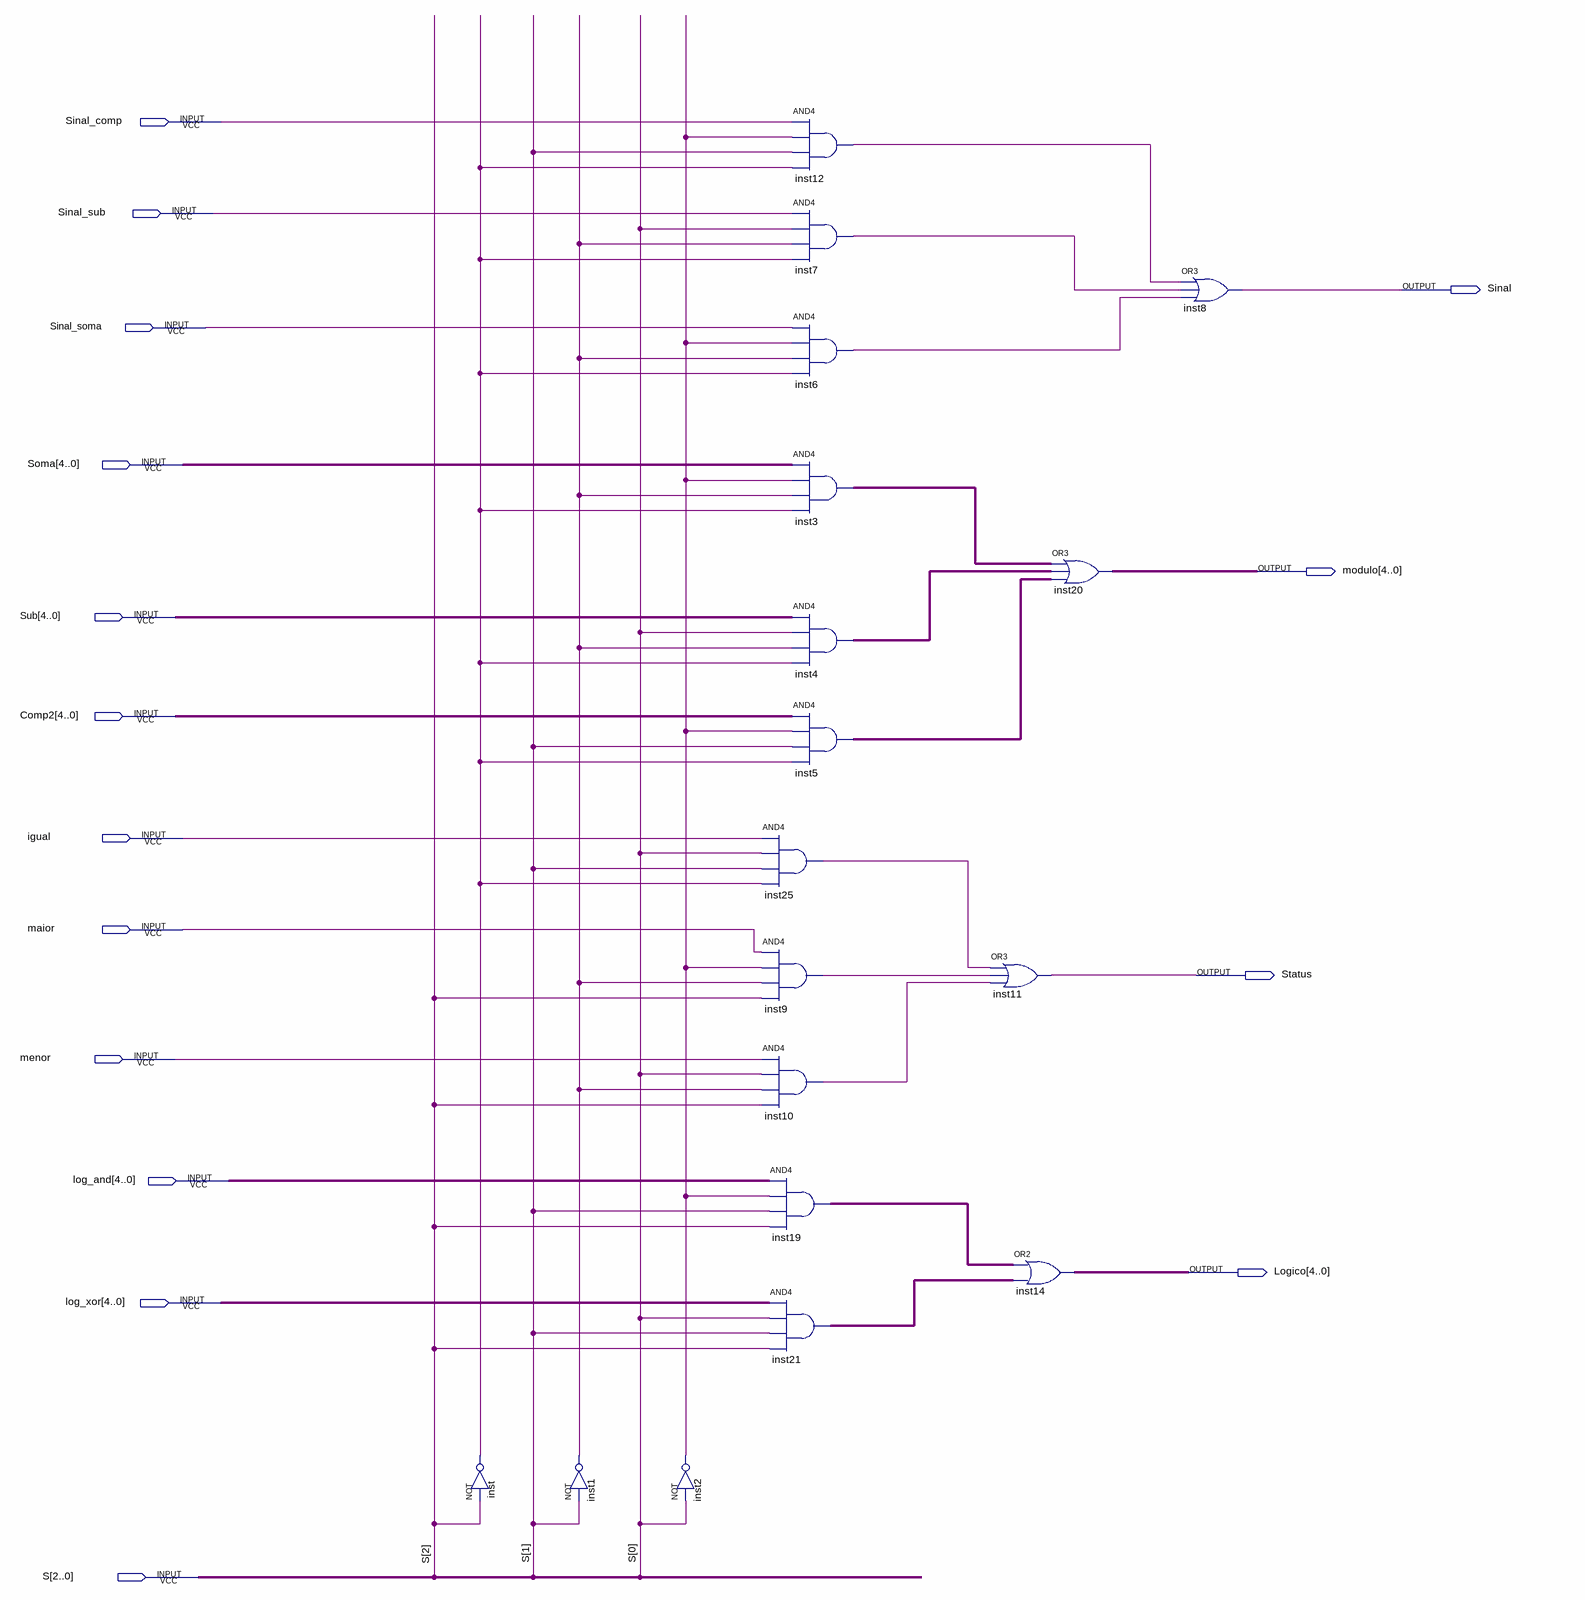
[diagram p0: schematic sheet]
// Quartus schematic Mux_p.bdf as structural Verilog: 18 symbols, 16 pins
module Mux_p (
  input  Sinal_comp,
  input  Sinal_sub,
  input  Sinal_soma,
  input  [4:0] Soma,
  input  [4:0] Sub,
  input  [4:0] Comp2,
  input  igual,
  input  maior,
  input  menor,
  input  [4:0] log_and,
  input  [4:0] log_xor,
  input  [2:0] S,
  output Sinal,
  output [4:0] modulo,
  output Status,
  output [4:0] Logico
);

  wire inst1_out, inst2_out, inst6_out, inst7_out, inst9_out, inst10_out, inst12_out, inst25_out, inst_out;
  wire [4:0] inst3_out, inst4_out, inst5_out, inst19_out, inst21_out;

  not inst (inst_out, S[2]);
  not inst1 (inst1_out, S[1]);
  not inst2 (inst2_out, S[0]);
  and inst25 (inst25_out, igual, S[0], S[1], inst_out);
  and inst9 (inst9_out, maior, inst2_out, inst1_out, S[2]);
  and inst10 (inst10_out, menor, S[0], inst1_out, S[2]);
  and inst12 (inst12_out, Sinal_comp, inst2_out, S[1], inst_out);
  and inst7 (inst7_out, Sinal_sub, S[0], inst1_out, inst_out);
  and inst6 (inst6_out, Sinal_soma, inst2_out, inst1_out, inst_out);
  assign inst3_out = Soma & {5{inst2_out}} & {5{inst1_out}} & {5{inst_out}};  // AND4 inst3, 5 bits wide
  assign inst4_out = Sub & {5{S[0]}} & {5{inst1_out}} & {5{inst_out}};  // AND4 inst4, 5 bits wide
  assign inst5_out = Comp2 & {5{inst2_out}} & {5{S[1]}} & {5{inst_out}};  // AND4 inst5, 5 bits wide
  assign inst19_out = log_and & {5{inst2_out}} & {5{S[1]}} & {5{S[2]}};  // AND4 inst19, 5 bits wide
  assign inst21_out = log_xor & {5{S[0]}} & {5{S[1]}} & {5{S[2]}};  // AND4 inst21, 5 bits wide
  or inst11 (Status, inst25_out, inst9_out, inst10_out);
  assign modulo = inst3_out | inst4_out | inst5_out;  // OR3 inst20, 5 bits wide
  assign Logico = inst19_out | inst21_out;  // OR2 inst14, 5 bits wide
  or inst8 (Sinal, inst12_out, inst7_out, inst6_out);
endmodule
